# Altium project LED Multivibrator.PrjPcb
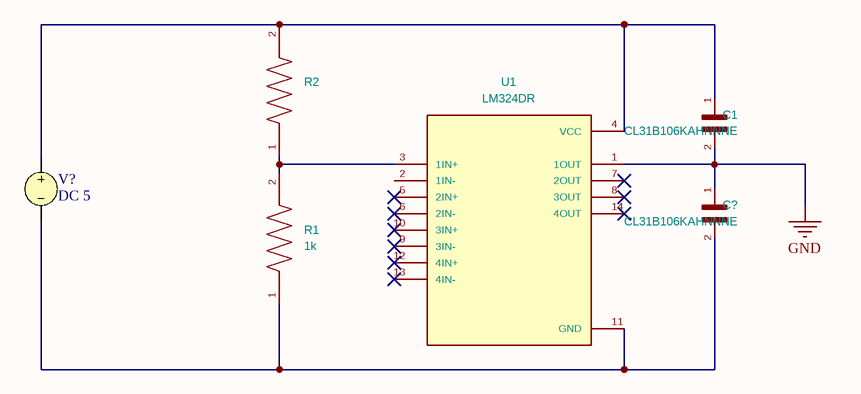
[diagram p0: LED Multivibrator.SchDoc]
1 sheet, 6 parts. Net scope: global (net labels, ports and power ports of the same name join across sheets).
Board file: PCB1.PcbDoc

## Sheet LED Multivibrator.SchDoc
size 297 x 209 mm

### Parts
C1  CL31B106KAHNNNE  [CAPC3216X180N]
C?  CL31B106KAHNNNE  [CAPC3216X180N]
R1  1k  [RESC3216X70N]
R2  1k  [RESC3216X70N]  (value not drawn)
U1  LM324DR  [SOIC127P600X175-14N]
V?  DC 5

### Nets
GND: C1.2 C?.1 U1.1(1OUT)
NetC1_1: C1.1 R2.2 U1.4(VCC) V?.1
NetC?_2: C?.2 R1.1 U1.11(GND) V?.2
NetR1_2: R1.2 R2.1 U1.3(1IN+)

Not connected (* = marked no-connect by the designer): U1 2(1IN-) 5(2IN+)* 6(2IN-)* 7(2OUT)* 8(3OUT)* 9(3IN-)* 10(3IN+)* 12(4IN+)* 13(4IN-)* 14(4OUT)*

### Notes on the sheet
- 1
- 2
- 3
- 4
- 5
- 6
- A
- B
- C
- D
- Title:
- File: LED Multivibrator.kicad_sch
- Sheet: /
- KiCad E.D.A.  kicad (5.1.4)-1
- Size: A4
- Date:
- Rev:
- Id: 1/1

### Library data of the parts
C1 C? = CL31B106KAHNNNE: L1_min: 0.2; E_min: 1.4; MF: Samsung Electro-Mechanics; D_min: 3.0; D_nom: 3.2; E_max: 1.8; L_max: 0.8; L1_nom: 0.5; Description_1: CL31 Series 10 uF 25 V ±10 % Tolerance X7R SMT Multilayer Ceramic Capacitor; D_max: 3.4; E_nom: 1.6; Check_prices: https://www.snapeda.com/parts/CL31B106KAHNNNE/Samsung/view-part/?ref=eda; Package: SMD-2 Samsung; SnapEDA_Link: https://www.snapeda.com/parts/CL31B106KAHNNNE/Samsung/view-part/?ref=snap; STANDARD: IPC 7351B; L_min: 0.2; A_max: 1.8; A_nom: 1.8; L1_max: 0.8; A_min: 1.8; Availability: In Stock; MP: CL31B106KAHNNNE; MANUFACTURER: Samsung Electro-Mechanics; Price: None; L_nom: 0.5; Value: CL31B106KAHNNNE; Footprint: CL31B106KAHNNNE:CAPC3216X180N
R1 R2 = RMCF1206JG100K: MF: Stackpole Electronics Inc; Description_1: 100 kOhms ±5% 0.25W, 1/4W Chip Resistor 1206 (3216 Metric) Automotive AEC-Q200 Thick Film; Package: 3216 Stackpole; Price: None; SnapEDA_Link: https://www.snapeda.com/parts/RMCF1206JG100K/Stackpole+Electronics/view-part/?ref=snap; MP: RMCF1206JG100K; Availability: In Stock; Check_prices: https://www.snapeda.com/parts/RMCF1206JG100K/Stackpole+Electronics/view-part/?ref=eda; Footprint: RMCF1206JG100K:RESC3216X70N
  R1: Value: 1k
U1 = LM324DR: MF: Texas Instruments; Description_1: Quad 30-V 1.2-MHz operational amplifier; Package: SOIC-14 Texas Instruments; Price: None; SnapEDA_Link: https://www.snapeda.com/parts/LM324DR/Texas+Instruments/view-part/?ref=snap; MP: LM324DR; Availability: In Stock; Check_prices: https://www.snapeda.com/parts/LM324DR/Texas+Instruments/view-part/?ref=eda; Value: LM324DR; Footprint: LM324DR:SOIC127P600X175-14N
V? = VSRC: Voltage Source; Note: PCB Footprint - Not required; AC Magnitude: 1; AC Phase: 0; Value: 5; Published: 8-Jun-2000; LatestRevisionDate: 17-Jul-2002; LatestRevisionNote: Re-released for DXP Platform.; PackageReference: Not Applicable; Publisher: Altium Limited